# EAGLE design C=Keyv3.1 (EAGLE 7.7.0)
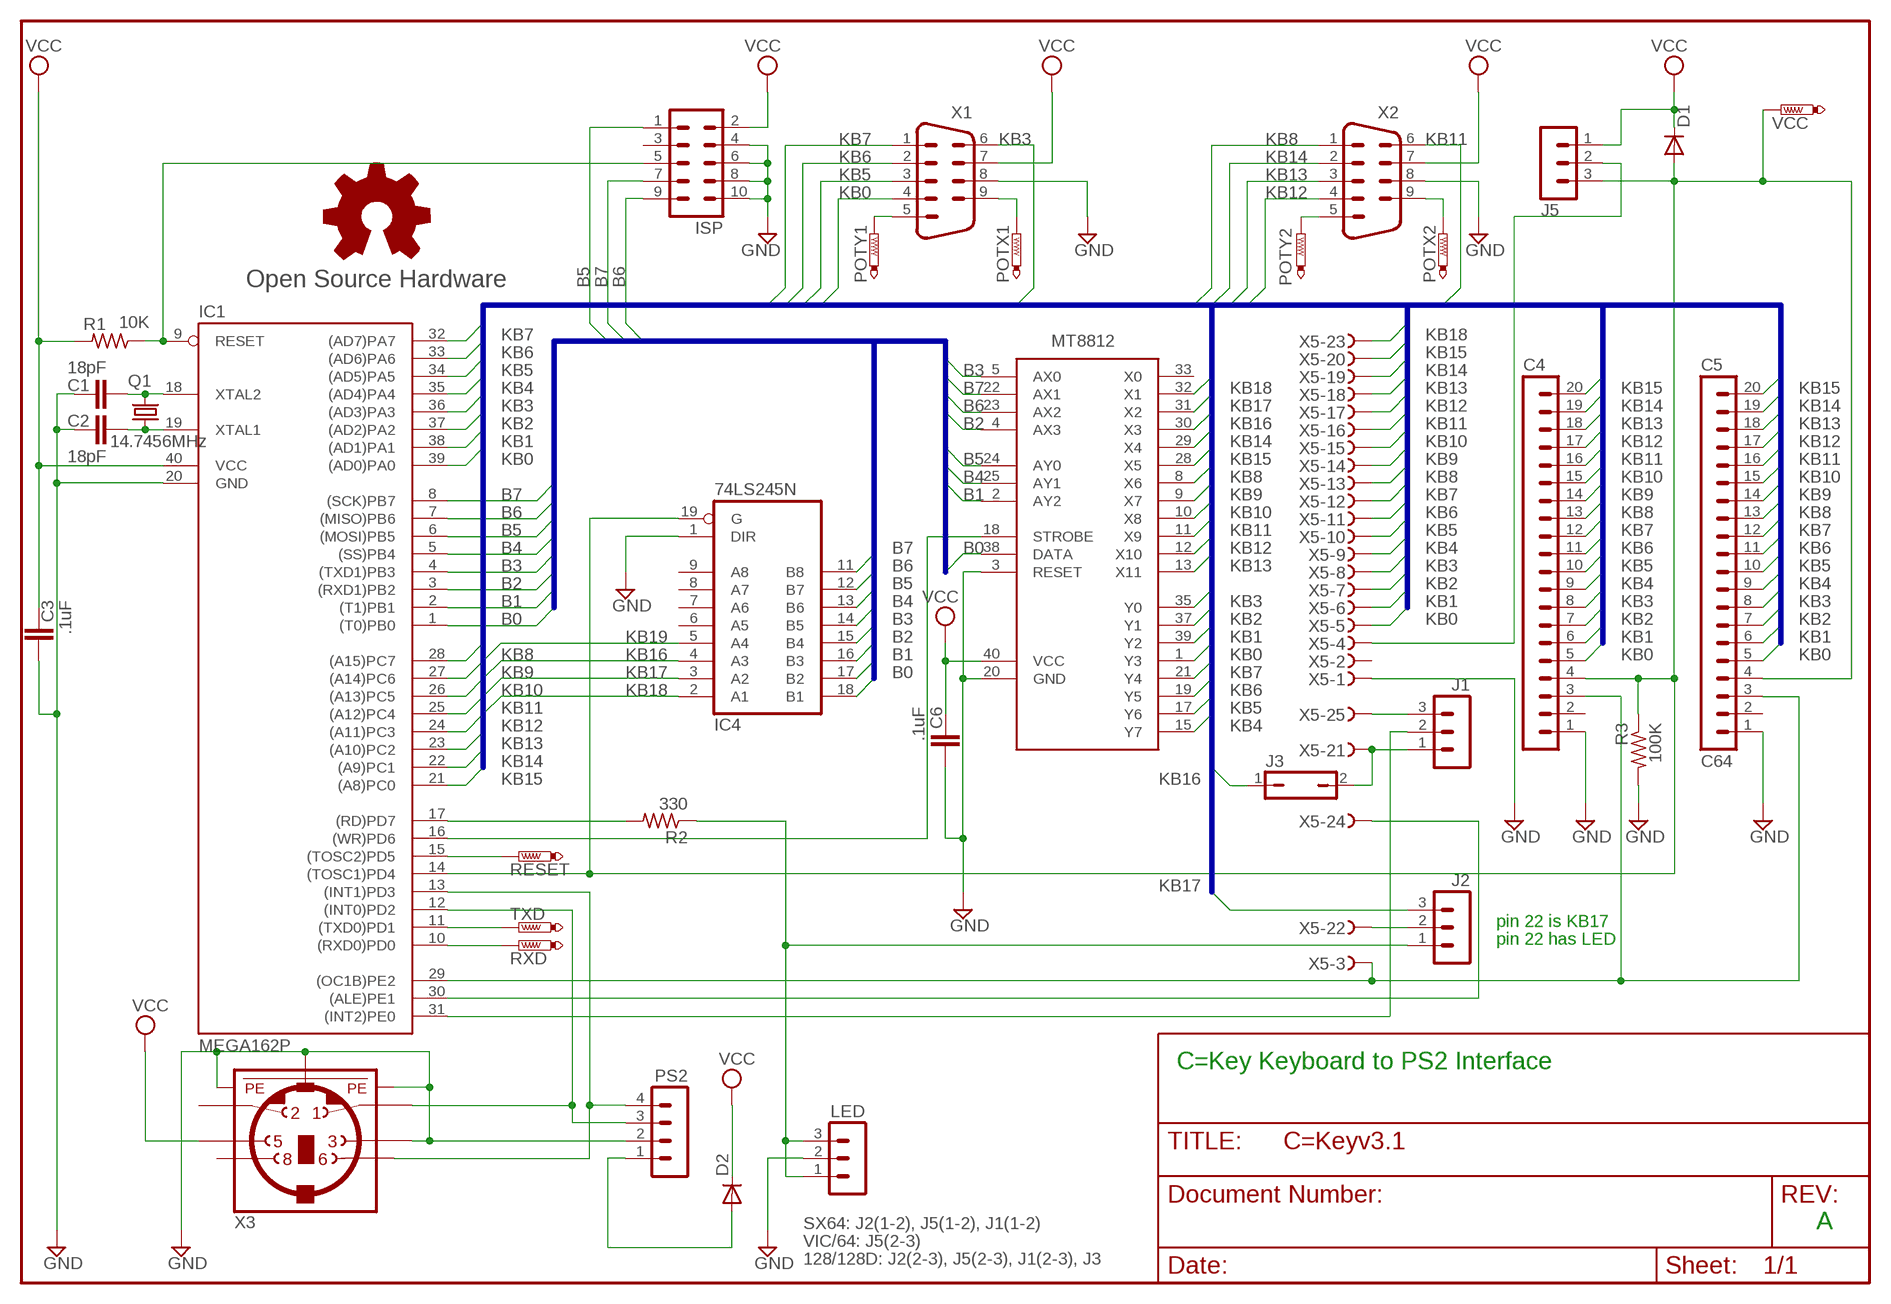
[diagram p0: schematic, sheet 1]

## Parts
C1  18pF  C2.5/2  [C2.5-2]
C2  18pF  C2.5/2  [C2.5-2]
C3  .1uF  C2.5/2  [C2.5-2]
C4  MA20-1  [MA20-1]
C5  C64  MA20-1  [MA20-1]
C6  .1uF  C2.5/2  [C2.5-2]
D1  DIODE-DO41-10  [DO41-10]
D2  DIODE-DO41-10  [DO41-10]
GOLD_ORB_SM1  Open Source Hardware  OSHWLOGOLOGO5MM  [OSHW_5MM]
IC1  MEGA162P  MEGA161P  [DIL40]
IC2  MT8812-P  [DIP40]
IC4  74LS245N  [DIL20]
ISP  MA05-2  [MA05-2]
J1  MA03-1  [MA03-1]
J2  MA03-1  [MA03-1]
J3  JP1Q  [JP1]
J5  MA03-1  [MA03-1]
LED  MA03-1  [MA03-1]
POTX1  PTR1PAD1-13  [P1-13]
POTX2  PTR1PAD1-13  [P1-13]
POTY1  PTR1PAD1-13  [P1-13]
POTY2  PTR1PAD1-13  [P1-13]
PS2  MA04-1  [MA04-1]
Q1  14.7456MHz  CRYTALHC49U-V  [HC49U-V]
R1  10K  R-US_0204/5  [0204/5]
R2  330  R-US_0204/5  [0204/5]
R3  100K  R-US_0204/2V  [0204V]
RESET  PTR1PAD1-13  [P1-13]
RXD  PTR1PAD1-13  [P1-13]
TXD  PTR1PAD1-13  [P1-13]
VCC  PTR1PAD1-13  [P1-13]
X1  M09HP  [M09HP]
X2  M09HP  [M09HP]
X3  MINI_DIN_6  [M_DIN6]
X5  F25HPS  [F25HP]

## Nets
B0: IC1.1((T0)PB0) IC2.38(DATA) IC4.18(B1)
B1: IC1.2((T1)PB1) IC2.2(AY2) IC4.17(B2)
B2: IC1.3((RXD1)PB2) IC2.4(AX3) IC4.16(B3)
B3: IC1.4((TXD1)PB3) IC2.5(AX0) IC4.15(B4)
B4: IC1.5((SS)PB4) IC2.25(AY1) IC4.14(B5)
B5: IC1.6((MOSI)PB5) IC2.24(AY0) IC4.13(B6) ISP.1
B6: IC1.7((MISO)PB6) IC2.23(AX2) IC4.12(B7) ISP.9
B7: IC1.8((SCK)PB7) IC2.22(AX1) IC4.11(B8) ISP.7
GND: C1.1 C2.1 C3.2 C4.1 C5.1 C6.2 IC1.20(GND) IC2.3(RESET) IC2.20(GND) IC4.1(DIR) ISP.4 ISP.6 ISP.8 ISP.10 LED.2 PS2.2 R3.2 X1.8 X2.8 X3.3 X3.SH1(PE1) X3.SH2(PE2) X3.SH3(PE3) X5.1
KB0: C4.5 C5.5 IC1.39((AD0)PA0) IC2.1(Y3) X1.4 X5.5
KB1: C4.6 C5.6 IC1.38((AD1)PA1) IC2.39(Y2) X5.6
KB2: C4.7 C5.7 IC1.37((AD2)PA2) IC2.37(Y1) X5.7
KB3: C4.8 C5.8 IC1.36((AD3)PA3) IC2.35(Y0) X1.6 X5.8
KB4: C4.9 C5.9 IC1.35((AD4)PA4) IC2.15(Y7) X5.9
KB5: C4.10 C5.10 IC1.34((AD5)PA5) IC2.17(Y6) X1.3 X5.10
KB6: C4.11 C5.11 IC1.33((AD6)PA6) IC2.19(Y5) X1.2 X5.11
KB7: C4.12 C5.12 IC1.32((AD7)PA7) IC2.21(Y4) X1.1 X5.12
KB8: C4.13 C5.13 IC1.28((A15)PC7) IC2.8(X6) X2.1 X5.13
KB9: C4.14 C5.14 IC1.27((A14)PC6) IC2.9(X7) X5.14
KB10: C4.15 C5.15 IC1.26((A13)PC5) IC2.10(X8) X5.15
KB11: C4.16 C5.16 IC1.25((A12)PC4) IC2.11(X9) X2.6 X5.16
KB12: C4.17 C5.17 IC1.24((A11)PC3) IC2.12(X10) X2.4 X5.17
KB13: C4.18 C5.18 IC1.23((A10)PC2) IC2.13(X11) X2.3 X5.18
KB14: C4.19 C5.19 IC1.22((A9)PC1) IC2.29(X4) X2.2 X5.19
KB15: C4.20 C5.20 IC1.21((A8)PC0) IC2.28(X5) X5.20
KB16: IC2.30(X3) IC4.4(A3) J3.1
KB17: IC2.31(X2) IC4.3(A2) J2.3
KB18: IC2.32(X1) IC4.2(A1) X5.23
KB19: IC4.5(A4)
N$1: D2.A PS2.1
N$2: IC1.31((INT2)PE0) J1.2
N$3: J1.3 X5.25
N$4: J1.1 J3.2 X5.21
N$5: J2.2 X5.22
N$6: IC1.9(RESET) ISP.5 R1.1
N$7: IC1.15((TOSC2)PD5) RESET.1(TP)
N$8: C4.4 C5.4 D1.A IC1.14((TOSC1)PD4) IC4.19(G) J5.3 R3.1 VCC.1(TP)
N$9: J5.2 X5.4
N$10: J2.1 LED.1 LED.3 R2.1
N$13: POTX1.1(TP) X1.9
N$14: POTX2.1(TP) X2.9
N$19: POTY2.1(TP) X2.5
N$21: IC1.16((WR)PD6) IC2.18(STROBE)
N$22: IC1.10((RXD0)PD0) RXD.1(TP)
N$23: IC1.11((TXD0)PD1) TXD.1(TP)
N$24: IC1.12((INT0)PD2) PS2.3 X3.1
N$25: IC1.13((INT1)PD3) PS2.4 X3.6
N$26: C4.3 C5.3 IC1.29((OC1B)PE2) X5.3
N$27: IC1.30((ALE)PE1) X5.24
N$30: IC1.17((RD)PD7) R2.2
N$31: C1.2 IC1.18(XTAL2) Q1.2
N$33: POTY1.1(TP) X1.5
N$34: C2.2 IC1.19(XTAL1) Q1.1
VCC: C3.1 C6.1 D1.C D2.C IC1.40(VCC) IC2.40(VCC) ISP.2 J5.1 R1.2 X1.7 X2.7 X3.5
Unconnected: C4.2 C5.2 IC2.33(X0) IC4.6(A5) IC4.7(A6) IC4.8(A7) IC4.9(A8) ISP.3 X3.2 X3.8 X5.2

## Buses
KB[0..19]
B[0..7]

## Notes on the sheet
- pin 22 is KB17
- pin 22 has LED
- C=Key Keyboard to PS2 Interface
- SX64: J2(1-2), J5(1-2), J1(1-2) | A
- VIC/64: J5(2-3)
- 128/128D: J2(2-3), J5(2-3), J1(2-3), J3

## Power pins joined to a net without a drawn wire
GND: IC4.10(GND)
VCC: IC4.20(VCC)

## Library data of the parts
C1-C3 C6 = capacitor-wima:C: CAPACITOR naming: grid - package width
C4 C5 = con-lstb:MA20-1: PIN HEADER
D1 D2 = diode:DIODE-: DIODE
GOLD_ORB_SM1 = oshw:OSHWLOGO: The OSHW logo for PCB layout
IC1 = avr:MEGA161*P: MICROCONTROLLER 16 Kbytes FLASH, 512 bytes EEPROM 1 Kbytes SRAM dual UART hardware multiplier
IC2 = MT8812:MT8812-P
IC4 = 74xx-us:74*245: Octal BUS TRANSCEIVER, 3-state
ISP = con-lstb:MA05-2: PIN HEADER
J1 J2 J5 LED = con-lstb:MA03-1: PIN HEADER
J3 = jumper:JP1Q: JUMPER
POTX1 POTX2 POTY1 POTY2 RESET RXD TXD VCC = testpad:PTR1: TEST PIN
PS2 = con-lstb:MA04-1: PIN HEADER
Q1 = crystal:CRYTAL: CRYSTAL
R1-R3 = rcl:R-US_: RESISTOR, American symbol
X1 X2 = con-subd:M09: SUB-D
X3 = mini_din:MINI_DIN_6
X5 = con-subd:F25?S: SUB-D

## Board
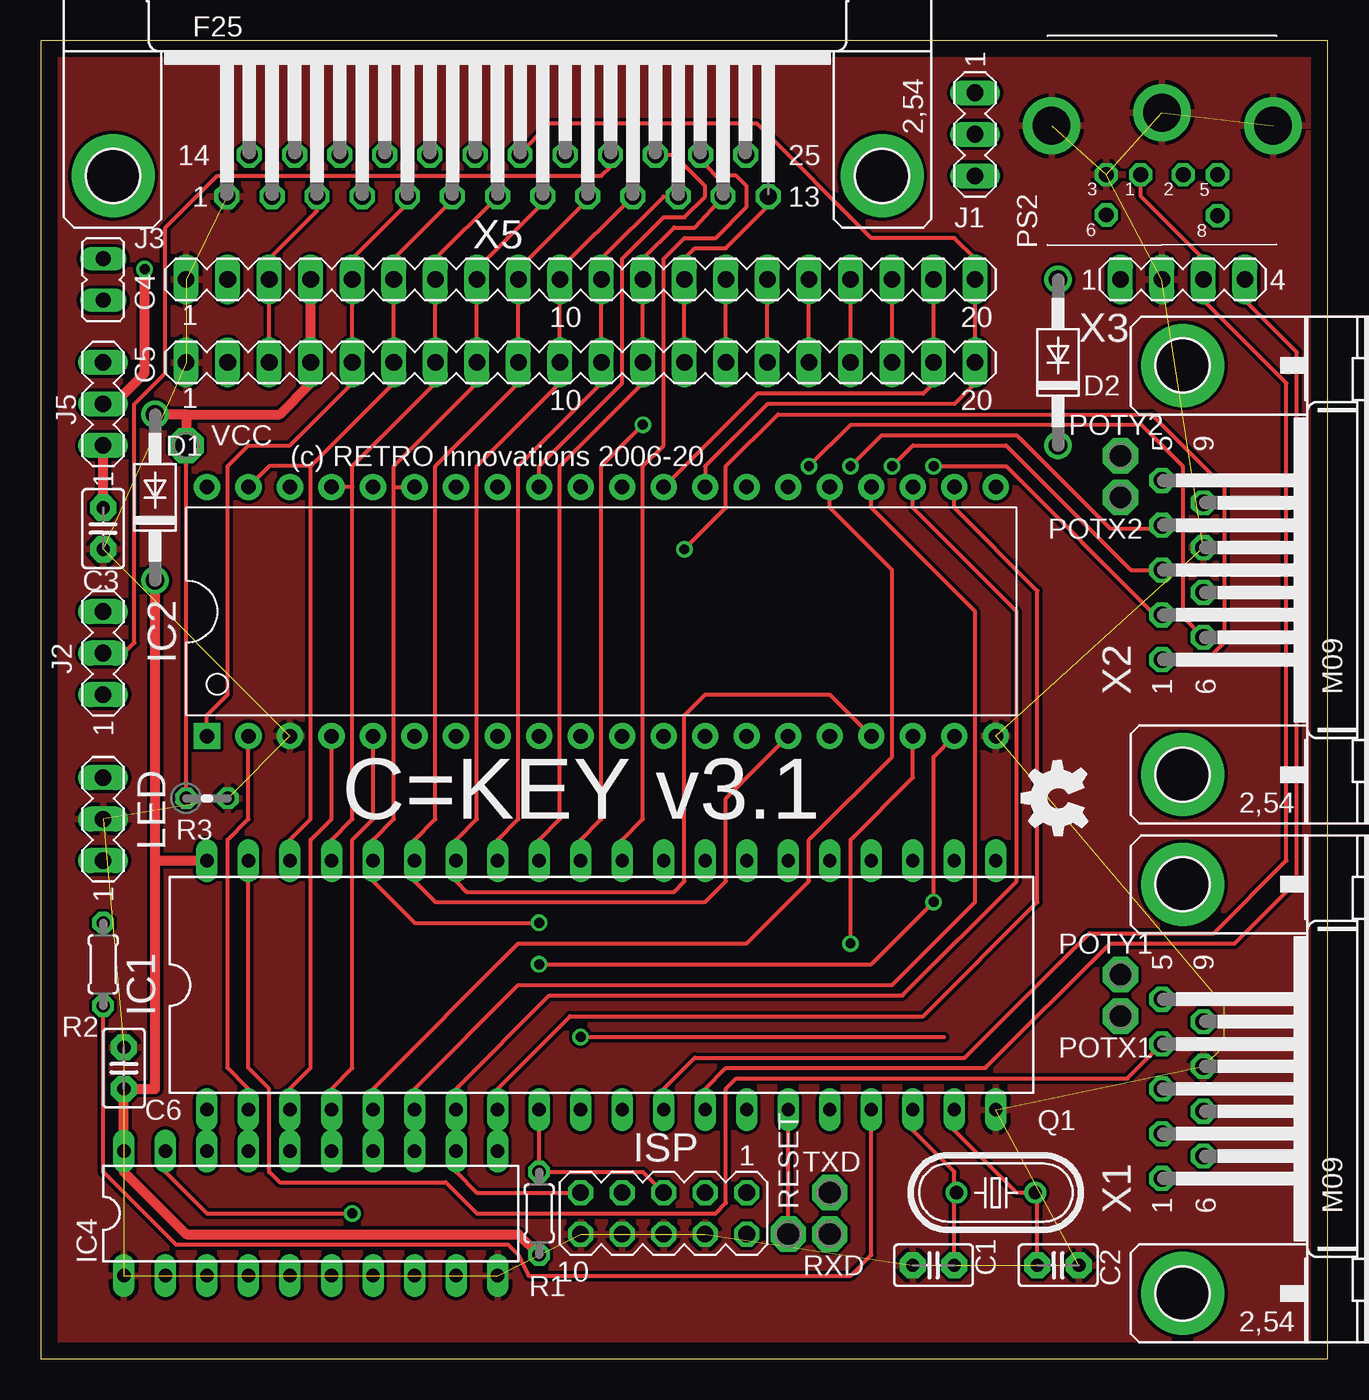
[diagram p1: board, top side]
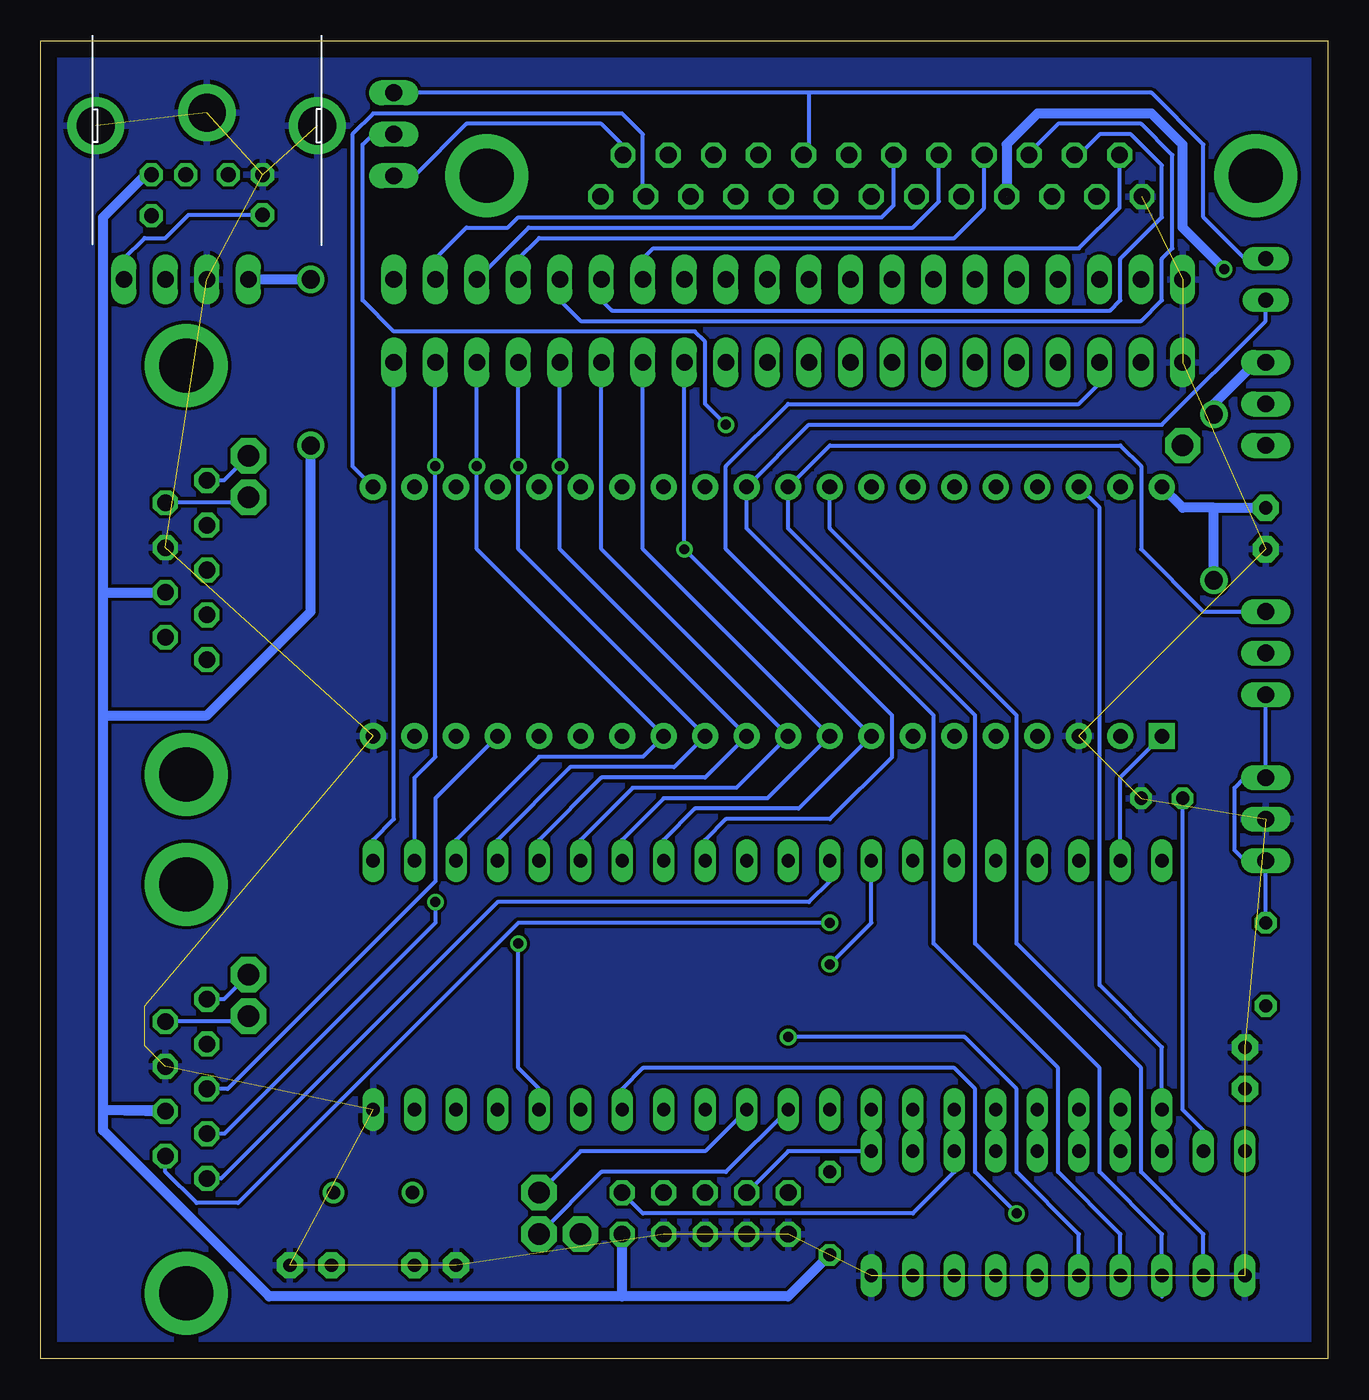
[diagram p2: board, bottom side, seen from below]

Size 78.74 x 80.64 mm. Coordinates in mm from the lower left corner, seen from the top.
Outline: 78.74,80.64 0,80.64 0,0 78.74,0 78.74,80.64
Copper layers (1*16): Top 0.035mm / dielectric 1.5mm / Bottom 0.035mm
Design rules "custompcb.revised": minimum track width 10mil, minimum drill 24mil, track to track 8mil, track to pad 8mil, pad to pad 8mil, via to via 8mil, smd to smd 8mil, copper to edge 40mil, drill to drill 12mil, minimum pad ring 10mil, minimum via ring 8mil, stop-mask expansion 0mil, vias tented up to drill 0mil, thermal gap 10mil

### Footprints (pad centres in the part's own frame; a part is rotated, then mirrored left to right if it is on the bottom)
C2.5-2 = drill 0.813 pad 1.6 octagon: 1 -1.27,0; 2 1.27,0
MA20-1 = drill 1.016 long: 1 -24.13,0; 2 -21.59,0; 3 -19.05,0; 4 -16.51,0; 5 -13.97,0; 6 -11.43,0; 7 -8.89,0; 8 -6.35,0; 9 -3.81,0; 10 -1.27,0; 11 1.27,0; 12 3.81,0; 13 6.35,0; 14 8.89,0; 15 11.43,0; 16 13.97,0; 17 16.51,0; 18 19.05,0; 19 21.59,0; 20 24.13,0
DO41-10 = drill 1.118: A 5.08,0; C -5.08,0
DIL40 = drill 0.813 long: 1 -24.13,-7.62; 2 -21.59,-7.62; 3 -19.05,-7.62; 4 -16.51,-7.62; 5 -13.97,-7.62; 6 -11.43,-7.62; 7 -8.89,-7.62; 8 -6.35,-7.62; 9 -3.81,-7.62; 10 -1.27,-7.62; 11 1.27,-7.62; 12 3.81,-7.62; 13 6.35,-7.62; 14 8.89,-7.62; 15 11.43,-7.62; 16 13.97,-7.62; 17 16.51,-7.62; 18 19.05,-7.62; 19 21.59,-7.62; 20 24.13,-7.62; 21 24.13,7.62; 22 21.59,7.62; 23 19.05,7.62; 24 16.51,7.62; 25 13.97,7.62; 26 11.43,7.62; 27 8.89,7.62; 28 6.35,7.62; 29 3.81,7.62; 30 1.27,7.62; 31 -1.27,7.62; 32 -3.81,7.62; 33 -6.35,7.62; 34 -8.89,7.62; 35 -11.43,7.62; 36 -13.97,7.62; 37 -16.51,7.62; 38 -19.05,7.62; 39 -21.59,7.62; 40 -24.13,7.62
DIP40 = drill 0.889 pad 1.6 square: 1 -22.86,-7.62 | drill 0.889 pad 1.6: 2 -20.32,-7.62; 3 -17.78,-7.62; 4 -15.24,-7.62; 5 -12.7,-7.62; 6 -10.16,-7.62; 7 -7.62,-7.62; 8 -5.08,-7.62; 9 -2.54,-7.62; 10 0,-7.62; 11 2.54,-7.62; 12 5.08,-7.62; 13 7.62,-7.62; 14 10.16,-7.62; 15 12.7,-7.62; 16 15.24,-7.62; 17 17.78,-7.62; 18 20.32,-7.62; 19 22.86,-7.62; 20 25.4,-7.62; 21 25.4,7.62; 22 22.86,7.62; 23 20.32,7.62; 24 17.78,7.62; 25 15.24,7.62; 26 12.7,7.62; 27 10.16,7.62; 28 7.62,7.62; 29 5.08,7.62; 30 2.54,7.62; 31 0,7.62; 32 -2.54,7.62; 33 -5.08,7.62; 34 -7.62,7.62; 35 -10.16,7.62; 36 -12.7,7.62; 37 -15.24,7.62; 38 -17.78,7.62; 39 -20.32,7.62; 40 -22.86,7.62
DIL20 = drill 0.813 long: 1 -11.43,-3.81; 2 -8.89,-3.81; 3 -6.35,-3.81; 4 -3.81,-3.81; 5 -1.27,-3.81; 6 1.27,-3.81; 7 3.81,-3.81; 8 6.35,-3.81; 9 8.89,-3.81; 10 11.43,-3.81; 11 11.43,3.81; 12 8.89,3.81; 13 6.35,3.81; 14 3.81,3.81; 15 1.27,3.81; 16 -1.27,3.81; 17 -3.81,3.81; 18 -6.35,3.81; 19 -8.89,3.81; 20 -11.43,3.81
MA05-2 = drill 1.016 octagon: 1 -5.08,-1.27; 2 -5.08,1.27; 3 -2.54,-1.27; 4 -2.54,1.27; 5 0,-1.27; 6 0,1.27; 7 2.54,-1.27; 8 2.54,1.27; 9 5.08,-1.27; 10 5.08,1.27
MA03-1 = drill 1.016 long: 1 -2.54,0; 2 0,0; 3 2.54,0
JP1 = drill 0.914 long: 1 0,-1.27; 2 0,1.27
P1-13 = drill 1.321 pad 2.159 octagon: 1 0,0
MA04-1 = drill 1.016 long: 1 -3.81,0; 2 -1.27,0; 3 1.27,0; 4 3.81,0
HC49U-V = drill 0.813: 1 -2.413,0; 2 2.413,0
0204/5 = drill 0.813 octagon: 1 -2.54,0; 2 2.54,0
0204V = drill 0.813 octagon: 1 -1.27,0; 2 1.27,0
M09HP = drill 1.016 octagon: 1 -5.486,1.27; 2 -2.743,1.27; 3 0,1.27; 4 2.743,1.27; 5 5.486,1.27; 6 -4.115,-1.27; 7 -1.372,-1.27; 8 1.372,-1.27; 9 4.115,-1.27 | drill 3.302 pad 5.08: G1 -12.522,0; G2 12.522,0
M_DIN6 = drill 0.9 pad 1.422 octagon: 1 -1.3,-3.75; 2 1.3,-3.75; 3 -3.4,-3.75; 5 3.4,-3.75; 6 -3.4,-6.2; 8 3.4,-6.25 | drill 2.3 pad 3.5: SH1 6.8,-0.75; SH2 0,0.05; SH3 -6.75,-0.75
F25HP = drill 1.016 octagon: 1 -16.561,-1.27; 2 -13.792,-1.27; 3 -11.049,-1.27; 4 -8.28,-1.27; 5 -5.512,-1.27; 6 -2.769,-1.27; 7 0,-1.27; 8 2.769,-1.27; 9 5.512,-1.27; 10 8.28,-1.27; 11 11.049,-1.27; 12 13.792,-1.27; 13 16.561,-1.27; 14 -15.189,1.27; 15 -12.421,1.27; 16 -9.652,1.27; 17 -6.909,1.27; 18 -4.14,1.27; 19 -1.372,1.27; 20 1.372,1.27; 21 4.14,1.27; 22 6.909,1.27; 23 9.652,1.27; 24 12.421,1.27; 25 15.189,1.27 | drill 3.302 pad 5.08: G1 -23.52,0; G2 23.52,0

### Placement (x,y rotation side)
C1  54.61,5.71 0 top
C2  62.23,5.71 180 top
C3  3.81,50.8 270 top
C4  33.02,66.04 0 top
C5  33.02,60.96 0 top
C6  5.08,17.78 90 top
D1  6.99,52.7 90 top
D2  62.23,60.96 90 top
GOLD_ORB_SM1  62.23,34.29 90 top
IC1  34.29,22.86 0 top
IC2  33.02,45.72 0 top
IC4  16.51,8.89 0 top
ISP  38.1,8.89 180 top
J1  57.15,74.93 270 top
J2  3.81,43.18 90 top
J3  3.81,66.04 0 top
J5  3.81,58.42 90 top
LED  3.81,33.02 90 top
POTX1  66.04,20.95 0 top
POTX2  66.04,52.7 0 top
POTY1  66.04,23.5 0 top
POTY2  66.04,55.24 0 top
PS2  69.85,66.04 0 top
Q1  58.42,10.16 180 top
R1  30.48,8.89 270 top
R2  3.81,24.13 270 top
R3  10.16,34.29 0 top
RESET  45.72,7.62 0 top
RXD  48.26,7.62 0 top
TXD  48.26,10.16 0 top
VCC  8.89,55.88 0 top
X1  69.85,16.51 90 top
X2  69.85,48.26 90 top
X3  68.58,76.2 0 top
X5  27.94,72.39 0 top

### Tracks (layer width: path | path; a pad name or v marks a point on that pad's centre or on a via)
B0
  Top 0.254: IC4.18 IC1.1
  Bottom 0.254: IC1.1 10.16,19.05 13.97,22.86 13.97,52.07 IC2.38
B1
  Top 0.254: IC4.17 IC1.2 12.7,16.51 11.43,17.78 11.43,31.75 12.7,33.02 IC2.2
B2
  Top 0.254: IC4.16 IC1.3 15.24,16.51 16.51,17.78 16.51,31.75 17.78,33.02 IC2.4
B3
  Top 0.254: IC4.15 IC1.4 17.78,16.51 19.05,17.78 19.05,31.75 20.32,33.02 IC2.5
B4
  Top 0.254: IC4.14 IC1.5 20.32,16.51 29.21,25.4 43.18,25.4 46.99,29.21 46.99,31.75 52.07,36.83 52.07,48.26 48.26,52.07 IC2.25
B5
  Top 0.254: IC4.13 IC1.6 22.86,16.51 29.21,22.86 52.07,22.86 57.15,27.94 57.15,45.72 50.8,52.07 IC2.24
  Bottom 0.254: IC4.13 22.86,11.43 25.4,8.89 41.91,8.89 ISP.1
B6
  Top 0.254: ISP.9 26.67,10.16 25.4,11.43 IC4.12 IC1.7 25.4,16.51 31.11,22.23 52.7,22.23 59.69,29.21 59.69,45.72 53.34,52.07 IC2.23
B7
  Top 0.254: IC4.11 IC1.8 27.94,16.51 32.38,20.95 53.98,20.95 60.96,27.94 60.96,46.99 55.88,52.07 IC2.22
  Bottom 0.254: ISP.7 33.02,12.7 IC4.11
GND  (26 unrouted)
  pour Top: 78.74,0 0,0 0,80.64 78.74,80.64
  pour Bottom: 78.74,0 0,0 0,80.64 78.74,80.64
KB0
  Top 0.254: X5.5 22.43,70.69 19.05,67.31 C4.5 C5.5 19.05,59.69 15.24,55.88 12.7,55.88 11.43,54.61 11.43,40.64 10.16,39.37 IC2.1 | IC1.39 12.7,17.78 13.97,16.51 13.97,11.43 14.61,10.79 24.77,10.79 26.67,8.89 41.27,8.89 41.91,9.53 41.91,16.51 42.55,17.14 66.47,17.14 X1.4
  Bottom 0.254: IC1.39 12.7,35.56 IC2.1
KB1
  Top 0.254: X5.6 25.17,70.89 21.59,67.31 C4.6 C5.6 21.59,59.69 16.51,54.61 | 16.51,54.61 16.51,33.02 15.24,31.75 IC1.38 | IC2.39 13.97,54.61 16.51,54.61
KB2
  Top 0.254: X5.7 24.13,67.31 C4.7 C5.7 24.13,59.69 19.05,54.61 19.05,53.34 | 19.05,53.34 19.05,33.02 17.78,31.75 IC1.37 | 19.05,53.34 IC2.37
KB3  (via drill 0.61)
  Top 0.254: X5.8 30.71,70.71 26.67,66.67 C4.8 C5.8 26.67,59.69 21.59,54.61 21.59,53.34 | 21.59,53.34 21.59,33.02 20.32,31.75 IC1.36 20.32,29.21 22.86,26.67 v30.48,26.67 | 21.59,53.34 IC2.35
  Bottom 0.254: v30.48,26.67 49.53,26.67 66.67,9.53 69.22,9.53 71.12,11.43 X1.6
KB4
  Top 0.254: X5.9 33.45,70.92 29.21,66.67 C4.9 C5.9 29.21,59.69 24.13,54.61 24.13,33.02 22.86,31.75 IC1.35 22.86,29.21 24.13,27.94 40.64,27.94 41.91,29.21 41.91,34.29 IC2.15
KB5
  Top 0.254: X5.10 36.2,71.12 31.75,66.67 C4.10 C5.10 31.75,59.69 26.67,54.61 26.67,33.02 25.4,31.75 IC1.34 25.4,29.21 26.04,28.57 38.73,28.57 39.37,29.21 39.37,39.37 40.64,40.64 48.26,40.64 IC2.17
  Bottom 0.254: X1.3 67.31,16.51 54.61,29.21 54.61,34.29 IC2.17
KB6  (via drill 0.61)
  Top 0.254: X5.11 38.1,71.12 34.29,67.31 C4.11 C5.11 34.29,59.69 29.21,54.61 29.21,33.02 27.94,31.75 IC1.33 | IC2.19 54.61,36.83 v54.61,27.94 50.8,24.13 v30.48,24.13
  Bottom 0.254: v30.48,24.13 27.94,26.67 IC1.33 | X1.2 67.51,13.77 54.61,26.67 v54.61,27.94
KB7
  Top 0.254: X5.12 40.01,69.22 38.73,69.22 36.83,67.31 C4.12 C5.12 36.83,59.69 31.75,54.61 31.75,33.02 30.48,31.75 IC1.32
  Bottom 0.254: IC2.21 59.69,54.61 59.69,74.93 58.42,76.2 43.18,76.2 41.91,74.93 41.91,71.12 X5.12 | X1.1 67.72,11.02 50.8,27.94 31.75,27.94 30.48,29.21 IC1.32
KB8  (via drill 0.61)
  Top 0.254: C5.13 C4.13 39.37,67.31 40.01,67.94 41.91,67.94 44.45,70.48 44.45,71.12 X5.13 | X2.1 71.35,42.77 72.39,43.81 72.39,53.34 67.94,57.78 45.09,57.78 41.91,54.61 41.91,52.07 v39.37,49.53
  Bottom 0.254: C5.13 v39.37,49.53 IC2.8 32.38,33.66 38.73,33.66 40.64,31.75 IC1.28
KB9
  Top 0.254: C5.14 C4.14
  Bottom 0.254: C4.14 41.91,67.31 41.27,67.94 15.24,67.94 12.75,70.43 12.75,73.61 12.7,73.66 X5.14 | IC1.27 43.18,31.75 40.64,34.29 34.29,34.29 IC2.9 41.91,49.53 C5.14
KB10
  Top 0.254: C5.15 C4.15
  Bottom 0.254: C4.15 44.45,64.77 43.81,64.14 13.34,64.14 12.7,64.77 12.7,67.31 10.16,69.85 10.16,73.03 12.06,74.93 13.97,74.93 15.24,73.66 X5.15 | C5.15 44.45,49.53 IC2.10 36.2,34.92 42.55,34.92 45.72,31.75 IC1.26
KB11  (via drill 0.61)
  Top 0.254: C5.16 C4.16 | X2.6 69.85,45.41 69.85,54.61 67.31,57.15 49.53,57.15 v46.99,54.61
  Bottom 0.254: C4.16 46.99,64.77 45.72,63.5 11.43,63.5 10.16,64.77 10.16,67.31 9.53,67.94 9.53,73.66 11.43,75.56 16.51,75.56 18.41,73.66 X5.16 | IC1.25 48.26,31.75 44.45,35.56 38.1,35.56 IC2.11 46.99,49.53 v46.99,54.61 C5.16
KB12  (via drill 0.61)
  Top 0.254: C5.17 C4.17 | X2.4 68.58,50.8 65.41,50.8 59.69,56.52 51.44,56.52 v49.53,54.61
  Bottom 0.254: C4.17 49.53,67.31 48.26,68.58 22.86,68.58 21.03,70.41 21.03,73.58 20.95,73.66 X5.17 | IC1.24 50.8,31.75 46.35,36.2 40.01,36.2 IC2.12 49.53,49.53 v49.53,54.61 C5.17
KB13  (via drill 0.61)
  Top 0.254: C5.18 C4.18 | X2.3 66.67,48.26 59.05,55.88 53.34,55.88 v52.07,54.61
  Bottom 0.254: C4.18 48.9,69.22 25.4,69.22 23.8,70.81 23.8,73.33 24.13,73.66 X5.18 | IC1.23 53.34,31.75 48.26,36.83 41.91,36.83 IC2.13 52.07,49.53 v52.07,54.61 C5.18
KB14  (via drill 0.61)
  Top 0.254: C4.19 C5.19 54.61,59.69 53.98,59.05 43.81,59.05 IC2.29 | X2.2 68.15,45.52 59.05,54.61 v54.61,54.61
  Bottom 0.254: C4.19 54.61,67.31 52.7,69.22 50.16,69.22 49.53,69.85 27.3,69.85 26.57,70.59 26.57,73.56 26.67,73.66 X5.19 | C5.19 v54.61,54.61 54.61,36.83 55.88,35.56 IC1.22
KB15
  Top 0.254: X5.20 29.21,73.66 31.11,75.56 43.81,75.56 50.8,68.58 55.88,68.58 57.15,67.31 C4.20 C5.20 57.15,59.69 55.88,58.42 44.45,58.42 40.64,54.61 IC2.28
  Bottom 0.254: IC1.21 58.42,31.75 57.15,33.02 C5.20
KB16
  Bottom 0.254: IC4.4 12.7,7.62 16.51,11.43 16.51,17.78 24.13,25.4 24.13,39.37 35.56,50.8 IC2.30 31.75,57.15 10.16,57.15 3.81,63.5 J3.1
KB17
  Bottom 0.254: 10.16,3.81 IC4.3 10.16,7.62 13.97,11.43 13.97,17.78 21.59,25.4 21.59,39.37 33.02,50.8 IC2.31 30.48,55.88 12.7,55.88 11.43,54.61 11.43,49.53 7.62,45.72 J2.3
KB18
  Top 0.254: X5.23 38.73,73.66 40.64,71.75 40.64,71.12 39.37,69.85 38.1,69.85 35.56,67.31 35.56,59.69 30.48,54.61 IC2.32
  Bottom 0.254: IC4.2 7.62,7.62 11.43,11.43 11.43,17.78 19.05,25.4 19.05,39.37 30.48,50.8 IC2.32
KB19  (via drill 0.61)
  Top 0.254: v33.02,19.68 55.24,19.68
  Bottom 0.254: IC4.5 15.24,7.62 19.05,11.43 19.05,16.51 22.23,19.68 v33.02,19.68
N$1
  Bottom 0.61: D2.A PS2.1
N$2  (via drill 0.61)
  Top 0.254: IC1.31 33.02,31.75 34.29,33.02 34.29,54.61 v36.83,57.15
  Bottom 0.254: v36.83,57.15 38.1,58.42 38.1,62.23 38.73,62.87 57.15,62.87 59.05,64.77 59.05,74.3 58.42,74.93 J1.2
N$3
  Bottom 0.254: J1.3 55.88,72.39 52.7,75.56 44.45,75.56 43.18,74.3 43.18,73.66 X5.25
N$4
  Bottom 0.254: J3.2 5.08,67.31 7.62,69.85 7.62,74.3 10.79,77.47 31.75,77.47 | 31.75,77.47 J1.1 | X5.21 32.38,73.66 31.75,74.3 31.75,77.47
N$5
  Top 0.254: X5.22 34.85,72.95 34.29,72.39 10.79,72.39 7.62,69.22 7.62,60.33 5.71,58.42 5.71,43.81 5.08,43.18 J2.2
N$6
  Top 0.254: ISP.5 36.83,11.43 R1.1 IC1.9
N$7
  Top 0.254: RESET.1 IC1.15
N$8  (via drill 0.61)
  Top 0.254: v19.05,8.89 10.16,8.89 7.62,11.43 IC4.19 | R3.1 8.89,57.78
  Top 0.61: 8.89,57.78 D1.A | 8.89,57.78 14.61,57.78 16.51,59.69 C5.4 C4.4 | 8.89,57.78 VCC.1
  Bottom 0.254: IC4.19 7.62,13.97 8.89,15.24 R3.1 | IC1.14 43.18,16.51 41.91,17.78 22.86,17.78 21.59,16.51 21.59,11.43 v19.05,8.89
  Bottom 0.61: D1.A 6.99,58.42 4.45,60.96 J5.3
N$9  (via drill 0.61)  (1 unrouted)
  Top 0.61: v6.35,66.67 6.35,60.33 4.45,58.42 J5.2
  Bottom 0.61: 19.66,71.09 19.66,74.32 17.78,76.2 10.79,76.2 8.89,74.3 8.89,69.22 v6.35,66.67
N$10
  Bottom 0.254: LED.3 5.08,35.56 5.71,34.92 5.71,31.11 5.08,30.48 LED.1 | LED.3 J2.1 LED.3 | LED.1 R2.1 LED.1
N$13
  Bottom 0.254: X1.9 67,20.62 POTX1.1
N$14
  Bottom 0.254: X2.9 67,52.38 POTX2.1
N$19
  Bottom 0.254: X2.5 67.54,53.75 POTY2.1
N$21  (via drill 0.61)
  Top 0.254: IC2.18 53.34,35.56 49.53,31.75 v49.53,25.4
  Bottom 0.254: v49.53,25.4 49.53,17.78 48.26,16.51 IC1.16
N$22
  Bottom 0.254: IC1.10 36.83,11.43 44.45,11.43 RXD.1
N$23
  Bottom 0.254: IC1.11 38.1,12.7 45.72,12.7 TXD.1
N$24
  Top 0.254: IC1.12 38.1,16.51 40.01,18.41 56.52,18.41 64.14,26.04 71.75,26.04 76.2,30.48 76.2,59.69 71.12,64.77 PS2.3 71.12,67.31 67.28,71.15 X3.1
N$25
  Top 0.254: IC1.13 40.64,16.51 41.91,17.78 57.78,17.78 65.41,25.4 73.03,25.4 76.83,29.21 76.83,61.59 73.66,64.77 PS2.4
  Bottom 0.254: X3.6 69.7,70 71.12,68.58 72.39,68.58 73.66,67.31 PS2.4
N$26
  Top 0.254: C5.3 C4.3 13.97,67.31 16.89,70.23 X5.3
  Bottom 0.254: IC1.29 38.1,31.75 36.83,33.02 30.48,33.02 26.67,36.83 26.67,39.37 36.83,49.53 36.83,54.61 33.02,58.42 15.24,58.42 13.97,59.69 C5.3
N$27
  Top 0.254: IC1.30 35.56,31.75 36.83,33.02 36.83,54.61 38.1,55.88 38.1,67.31 39.37,68.58 41.27,68.58 43.18,70.48 43.18,71.75 42.55,72.39 41.27,72.39 40.36,73.38 X5.24
N$30
  Top 0.254: R2.2 3.81,11.43 8.26,6.99 28.57,6.99 29.21,6.35 29.84,5.08 49.53,5.08 50.8,6.35 IC1.17
N$31
  Top 0.254: IC1.18 53.34,13.97 55.88,11.43 55.88,10.16 | 55.88,10.16 Q1.2 | C1.2 55.88,10.16
N$33
  Bottom 0.254: X1.5 67.54,22 POTY1.1
N$34
  Top 0.254: IC1.19 55.88,13.97 59.69,10.16 Q1.1 60.96,10.16 C2.2
VCC
  Top 0.61: 6.99,30.48 D1.C | 6.99,30.48 IC1.40 | 6.99,30.48 6.99,16.51 C6.1 IC4.20 5.08,11.43 8.89,7.62 29.21,7.62 R1.2 | C3.1 J5.1
  Bottom 0.61: 6.99,52.07 8.89,52.07 IC2.40 | 43.18,3.81 33.02,3.81 R1.2 | 74.93,15.24 71.12,15.24 X1.7 74.93,15.24 | 43.18,3.81 ISP.2 | 43.18,3.81 64.77,3.81 74.93,13.97 74.93,15.24 | D2.C 62.23,45.72 68.58,39.37 74.93,39.37 | X3.5 72.33,72.45 74.93,69.85 74.93,46.99 | 74.93,39.37 74.93,46.99 | 74.93,15.24 74.93,39.37 | D1.C 6.99,52.07 | 6.99,52.07 C3.1 | X2.7 74.83,46.89 74.93,46.99

### Text on the board
tPlace: (c) RETRO Innovations 2006-20 | C=KEY v3.1